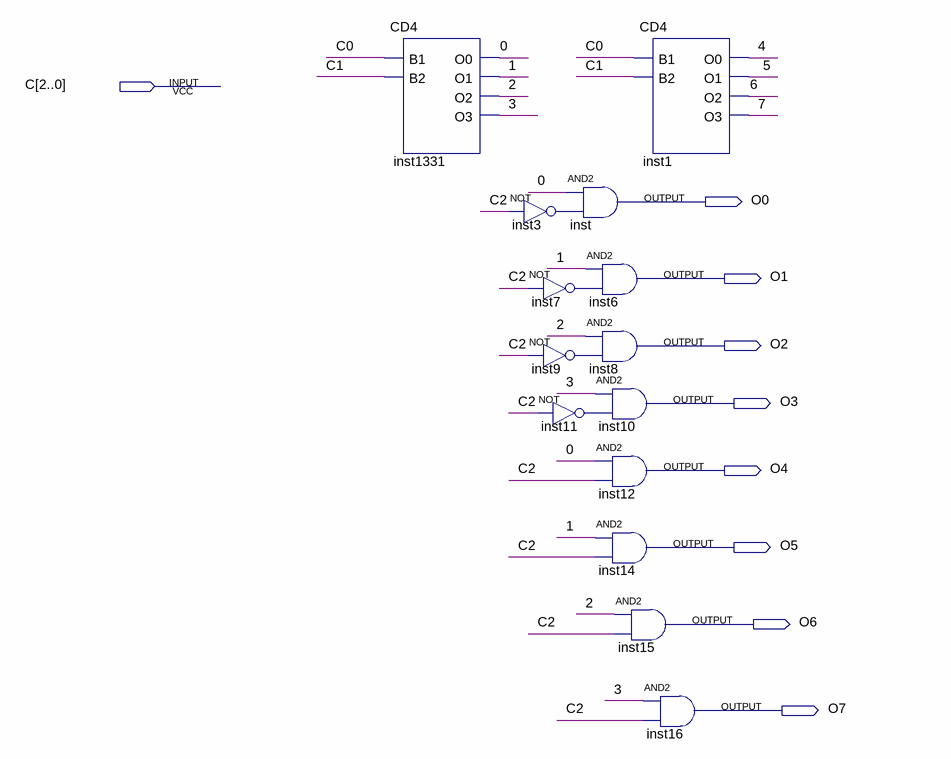
[diagram p0: schematic sheet]
// Quartus schematic CD8.bdf as structural Verilog: 14 symbols, 9 pins
module CD8 (
  input  [2:0] C,
  output O0,
  output O1,
  output O2,
  output O3,
  output O4,
  output O5,
  output O6,
  output O7
);

  wire \0 , \1 , \2 , \3 , \4 , \5 , \6 , \7 , inst3_out, inst7_out, inst9_out, inst11_out;

  CD4 inst1331 (.B1(C[0]), .B2(C[1]), .O0(\0 ), .O1(\1 ), .O2(\2 ), .O3(\3 ));
  and inst (O0, \0 , inst3_out);
  not inst3 (inst3_out, C[2]);
  not inst7 (inst7_out, C[2]);
  not inst9 (inst9_out, C[2]);
  not inst11 (inst11_out, C[2]);
  CD4 inst1 (.B1(C[0]), .B2(C[1]), .O0(\4 ), .O1(\5 ), .O2(\6 ), .O3(\7 ));
  and inst6 (O1, \1 , inst7_out);
  and inst8 (O2, \2 , inst9_out);
  and inst10 (O3, \3 , inst11_out);
  // AND2 inst12 has open pins: IN1=\0 , IN2=C[2], OUT=open
  and inst14 (O5, \1 , C[2]);
  and inst15 (O6, \2 , C[2]);
  and inst16 (O7, \3 , C[2]);
endmodule
